# Altium schematic sheet Power.SchDoc
size A4
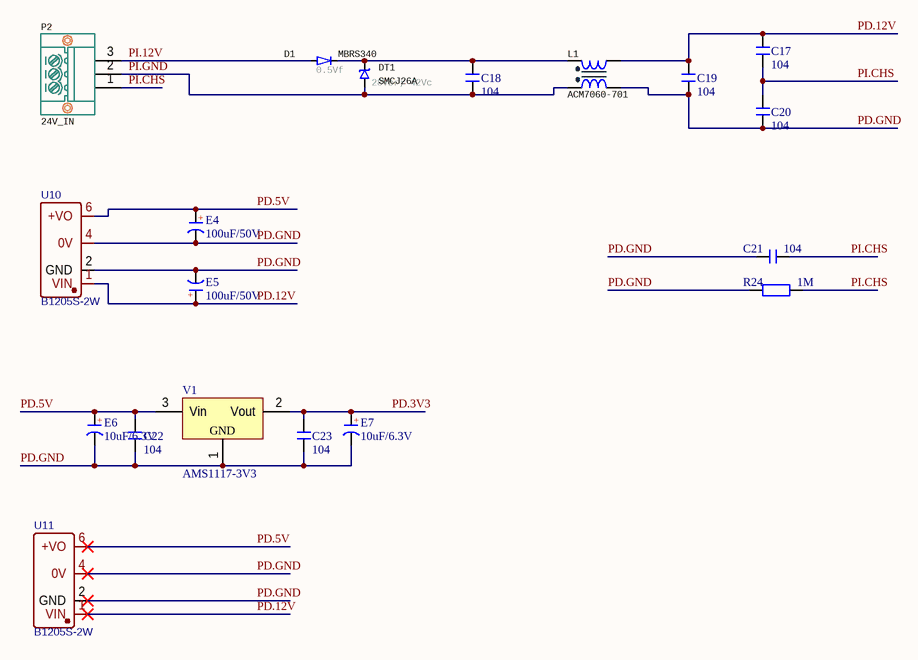
[diagram p0: Power.SchDoc]

## Parts
C17  104  [C 1210]
C18  104  [C 1210]
C19  104  [C 1210]
C20  104  [C 1210]
C21  104  [C 1210]
C22  104  [C 1210]
C23  104  [C 1210]
D1  MBRS340  01_INF: 0.5Vf  [D-SMC]
DT1  SMCJ26A  01_INF: 28Vbr; 42Vc  [D-SMC]
E4  100uF/50V  [CM F(10*10.2)]
E5  100uF/50V  [CM F(10*10.2)]
E6  10uF/6.3V  [CD A(3216)]
E7  10uF/6.3V  [CD A(3216)]
L1  ACM7060-701  [TDK_Choke_ACM7060]
P2  24V_IN  [C00170]
R24  1M  [R 1206_L]
U10  B1205S-2W  [B1205S-2W]
U11  B1205S-2W  [B1205S-2W]
V1  AMS1117-3V3  [SOT223_L]

## Nets
PD.3V3: C23.1 E7.1(A) V1.2(Vout)
PD.5V: C22.1 E4.1(A) E6.1(A) U10.6(+VO) U11.6(+VO) V1.3(Vin)
PD.12V: C17.1 C19.2 E5.1(A) L1.A2 U10.1(VIN) U11.1(VIN)
PD.GND: C19.1 C20.2 C21.1 C22.2 C23.2 E4.2(K) E5.2(K) E6.2(K) E7.2(K) L1.B2 R24.1 U10.2(GND) U10.4(0V) U11.2(GND) U11.4(0V) V1.1(GND)
PI.12V: D1.1 P2.3
PI.CHS: C17.2 C20.1 C21.2 P2.1 R24.2
PI.GND: C18.1 DT1.1 L1.B1 P2.2
NetC18_2: C18.2 D1.2 DT1.2 L1.A1

## Notes on the sheet
- (in symbol C-CD) +
- (in symbol C-CM) +

## Library data of the parts
C17-C23 = C: 无极性贴片电容; 版权归属: 源创客; BOM名称: 无极性贴片电容; 学习资源: www.ooocke.com
D1 = Diode: D-SMC-MBRS340; 02_CMT: OnSemi MBRS340T3G; 10_Code: C40326; 11_Name: 贴装元件_肖特基二极管_MBRS340_SMC
DT1 = Diode_TVS_UniDirectional: DT-SMC-SMCJ26A; 02_CMT: LittleFuse SMCJ26A; TM: GFE; 10_Code: C224046; 11_Name: 贴装元件_单向TVS_SMC_26V
E4 E5 = C-CM: 贴片电解电容; 版权归属: 源创客; BOM名称: 贴片电解电容; 学习资源: www.ooocke.com
E6 E7 = C-CD: 贴片钽电容; 版权归属: 源创客; BOM名称: 贴片钽电容; 学习资源: www.ooocke.com
L1 = IND_CHOKE: L-ACM7060-701; 10_Code: C78246; 11_Name: 贴装电感_共模_ACM7060-701-2PL-TL01
P2 = C00170_绿座_弯_针_单排_3.50_3P_紧固: P-插装绿座_弯_针_单排_3.5_3P_紧固; 11_Name: 插装绿座_弯_针_单排_3.5_3P_紧固
R24 = R: 贴片电阻; 版权归属: 源创客; BOM名称: 贴片电阻; 学习资源: www.ooocke.com
U10 U11 = B1205S-2W: BOM_Manufacturer: JETEKPS; Contributor: LCSC; BOM_Paste Type: expand; BOM_Supplier: LCSC; BOM_Supplier Part: C442553; BOM_Manufacturer Part: B1205S-2W; spicePre: U; spiceSymbolName: B1205S-2W
V1 = AMS1117: 三端稳压芯片; BOM名称: 稳压芯片; 版权归属: 源创客; 学习资源: www.ooocke.com